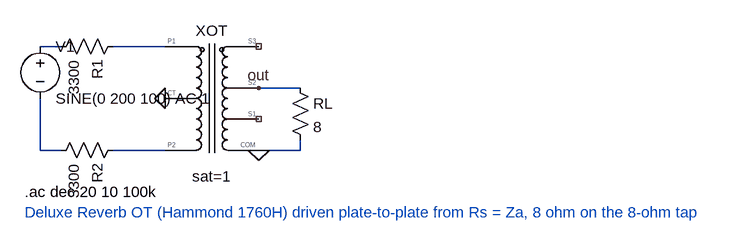
[diagram p0: schematic demo_output-transformer.asc]
demo_output-transformer.asc, the LTspice schematic file:
Version 4
SHEET 1 880 400
WIRE 64 112 96 112
WIRE 176 112 256 112
WIRE 64 192 64 272
WIRE 64 272 96 272
WIRE 176 272 256 272
WIRE 400 176 464 176
WIRE 464 256 464 272
WIRE 400 272 464 272
FLAG 256 192 0
FLAG 400 272 0
FLAG 400 176 out
SYMBOL voltage 64 96 R0
SYMATTR InstName V1
SYMATTR Value SINE(0 200 100) AC 1
SYMBOL res 192 96 R90
SYMATTR InstName R1
SYMATTR Value 3300
SYMBOL res 192 256 R90
SYMATTR InstName R2
SYMATTR Value 3300
SYMBOL OT_1760H 256 96 R0
SYMATTR InstName XOT
SYMATTR Value sat=1
SYMBOL res 448 160 R0
SYMATTR InstName RL
SYMATTR Value 8
TEXT 40 336 Left 2 !.ac dec 20 10 100k
TEXT 40 368 Left 2 ;Deluxe Reverb OT (Hammond 1760H) driven plate-to-plate from Rs = Za, 8 ohm on the 8-ohm tap

The netlist it stands for:
* demo_output-transformer.asc
V1 N001 N003 SINE(0 200 100) AC 1
R1 N002 N001 3300
R2 N004 N003 3300
XXOT N002 0 N004 0 NC_01 out NC_02 OT_1760H sat=1  ; pins P1 CT P2 COM S1 S2 S3
RL out 0 8
.ac dec 20 10 100k
* Deluxe Reverb OT (Hammond 1760H) driven plate-to-plate from Rs = Za, 8 ohm on the 8-ohm tap
.lib output-transformer.sub
.backanno
.end